# Altium schematic sheet 0136_BLANK.SchDoc
size 848 x 558 mm
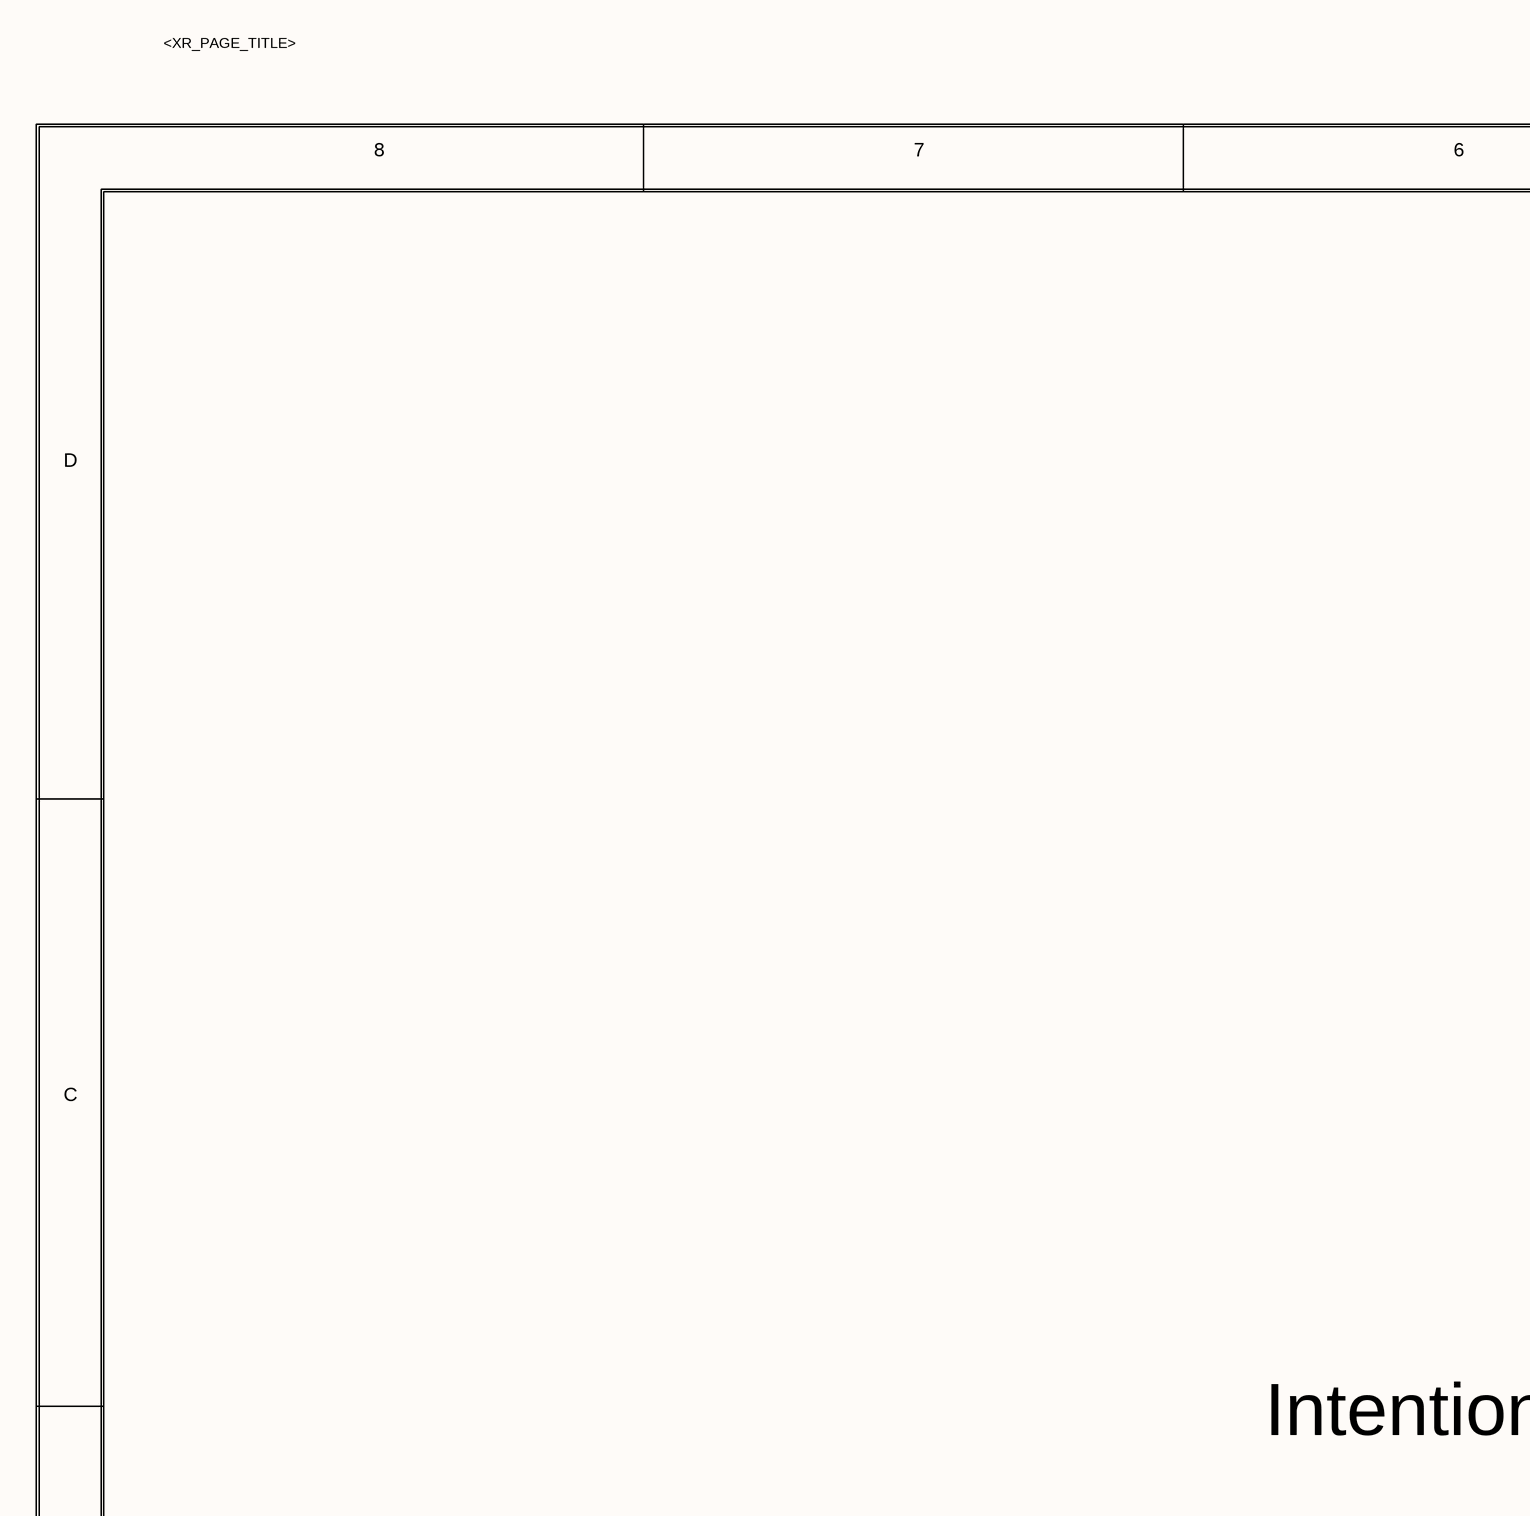
[diagram p0: 0136_BLANK.SchDoc, top left]
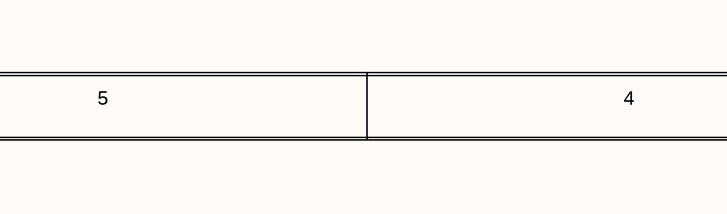
[diagram p1: 0136_BLANK.SchDoc, top middle]
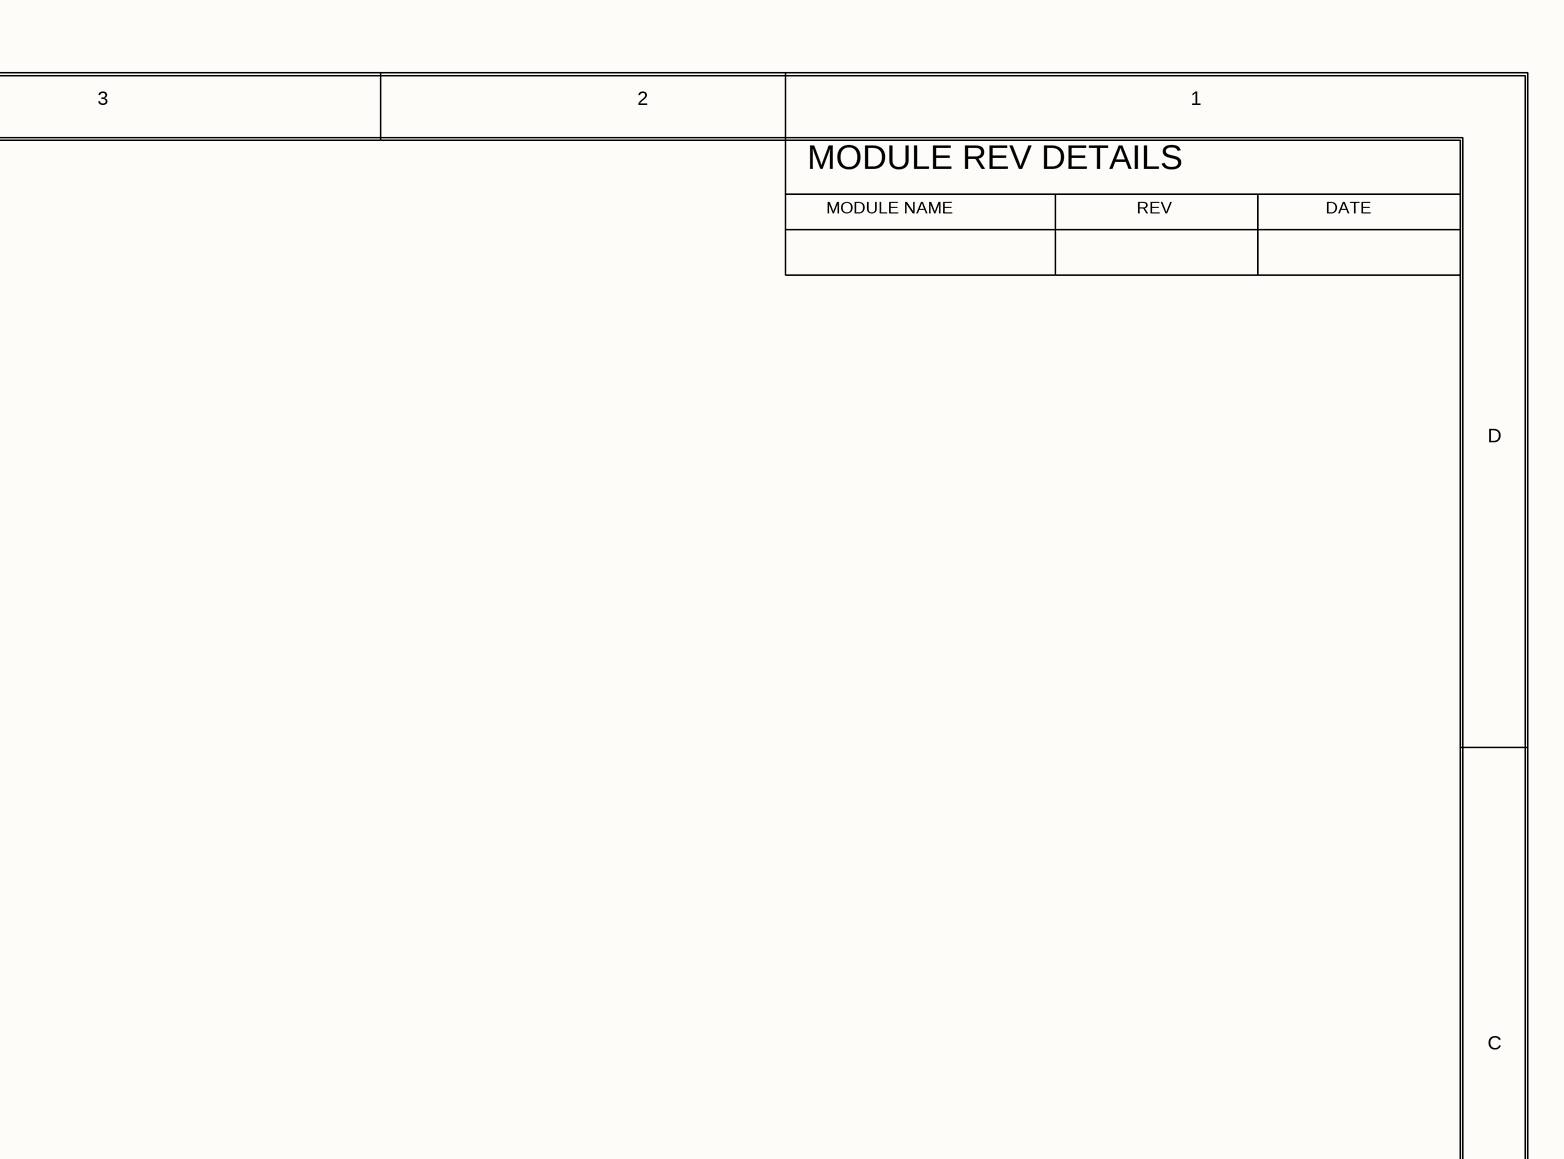
[diagram p2: 0136_BLANK.SchDoc, top right]
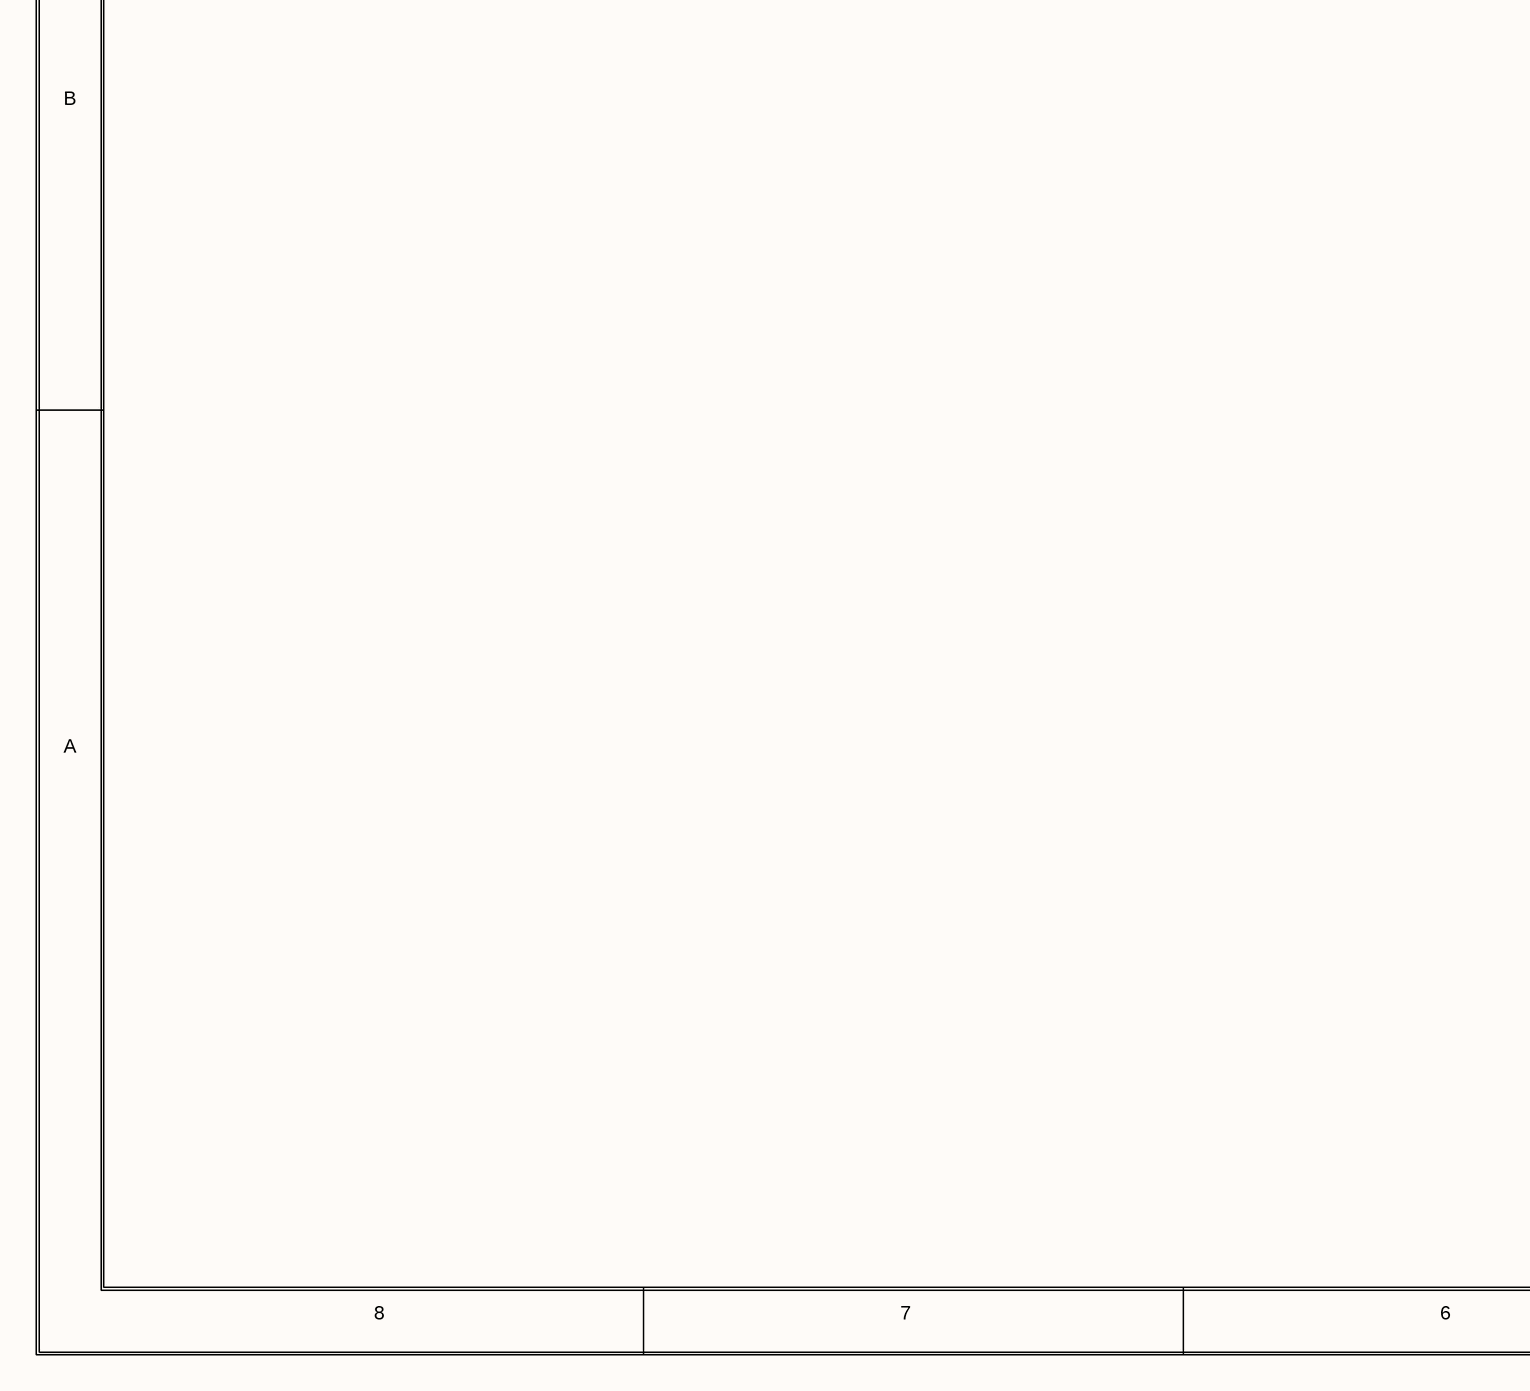
[diagram p3: 0136_BLANK.SchDoc, bottom left]
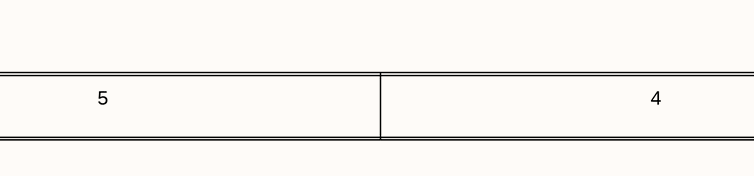
[diagram p4: 0136_BLANK.SchDoc, bottom middle]
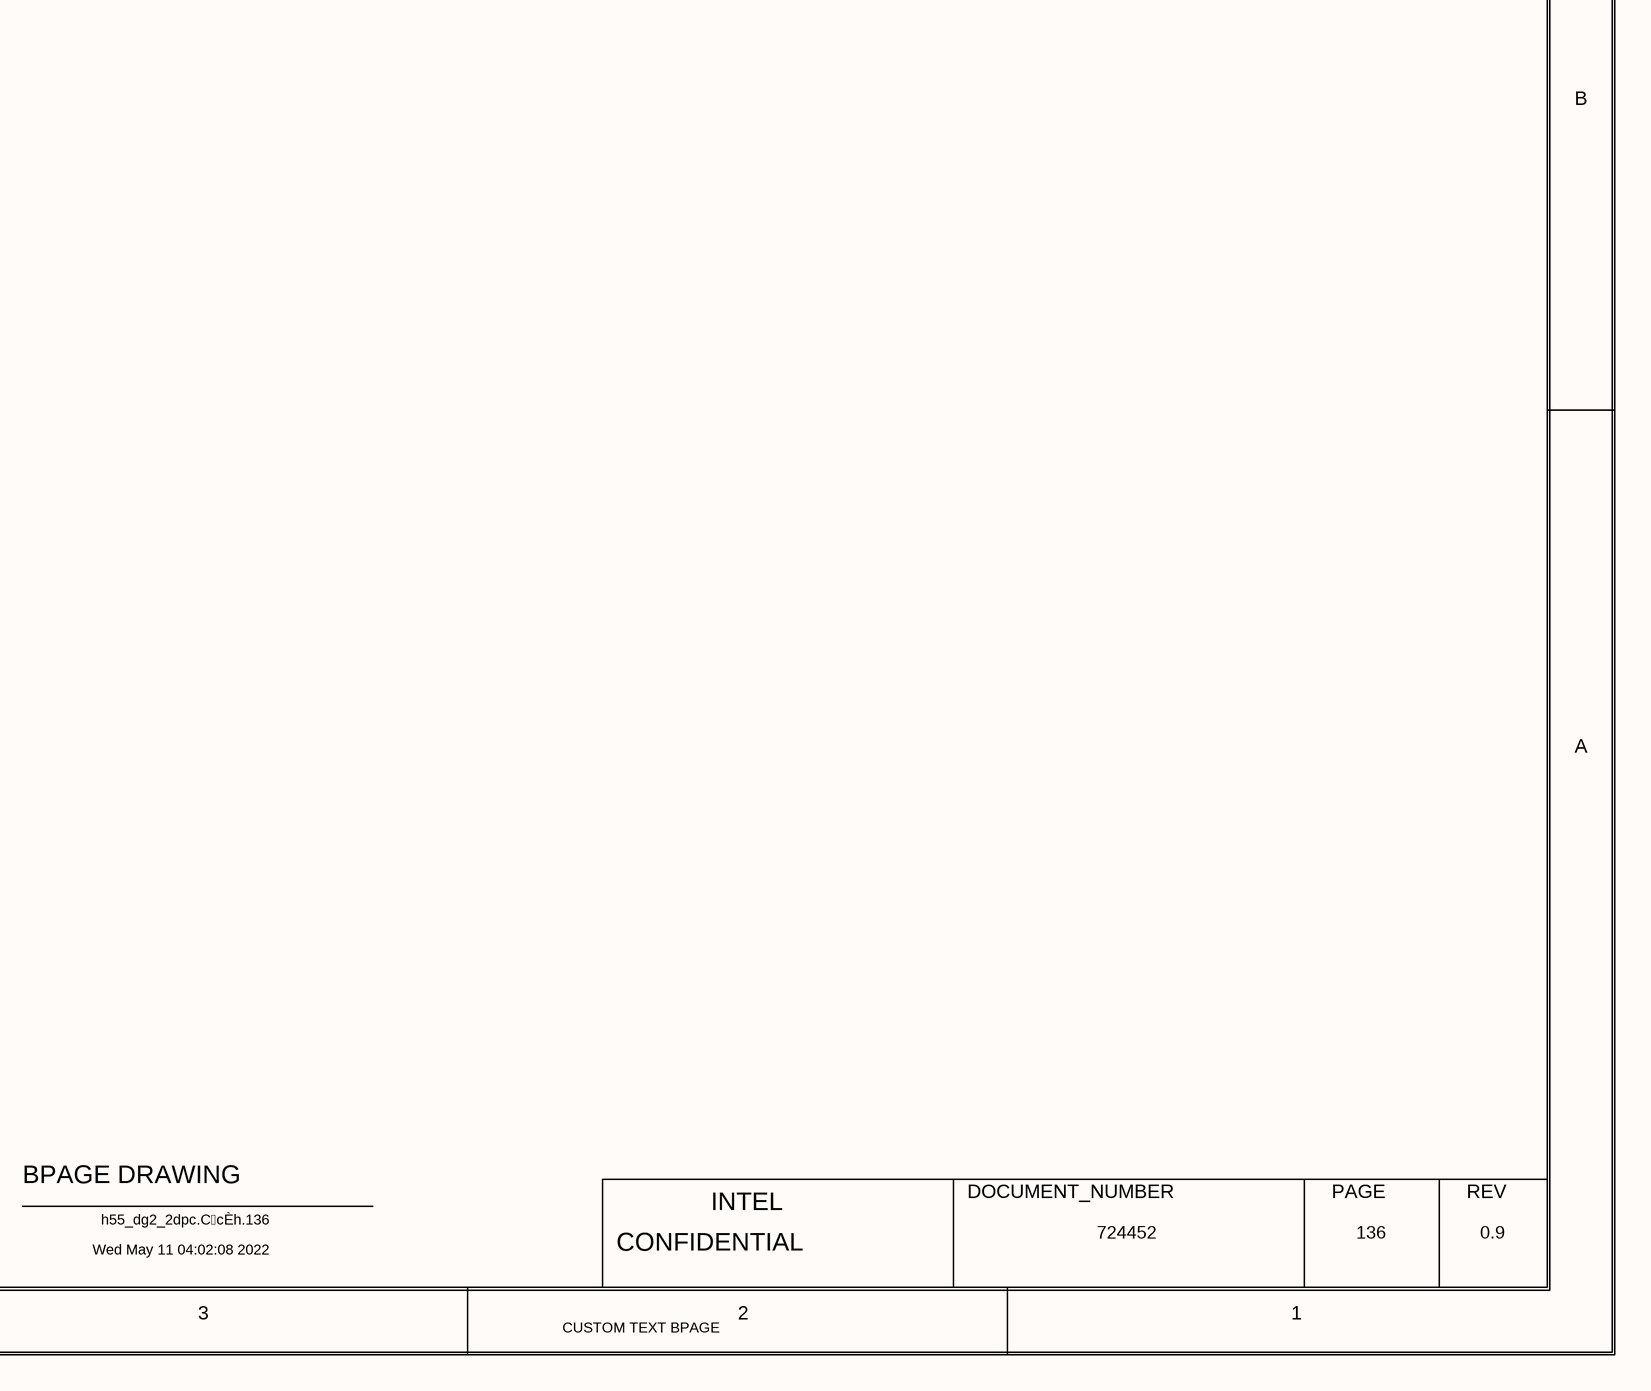
[diagram p5: 0136_BLANK.SchDoc, bottom right]

## Notes on the sheet
- <XR_PAGE_TITLE>
- 8
- 7
- 6
- 5
- 4
- 3
- 2
- 1
- MODULE REV DETAILS
- MODULE NAME
- REV
- DATE
- D
- C
- Intentionally Left Blank
- B
- A
- BPAGE DRAWING
- INTEL
- DOCUMENT_NUMBER
- PAGE
- Wed May 11 04:02:08 2022
- h55_dg2_2dpc.CcÈh.136
- CONFIDENTIAL
- 724452
- 136
- 0.9
- CUSTOM TEXT BPAGE